# Altium schematic sheet SystemStatusBoard.SchDoc
size C
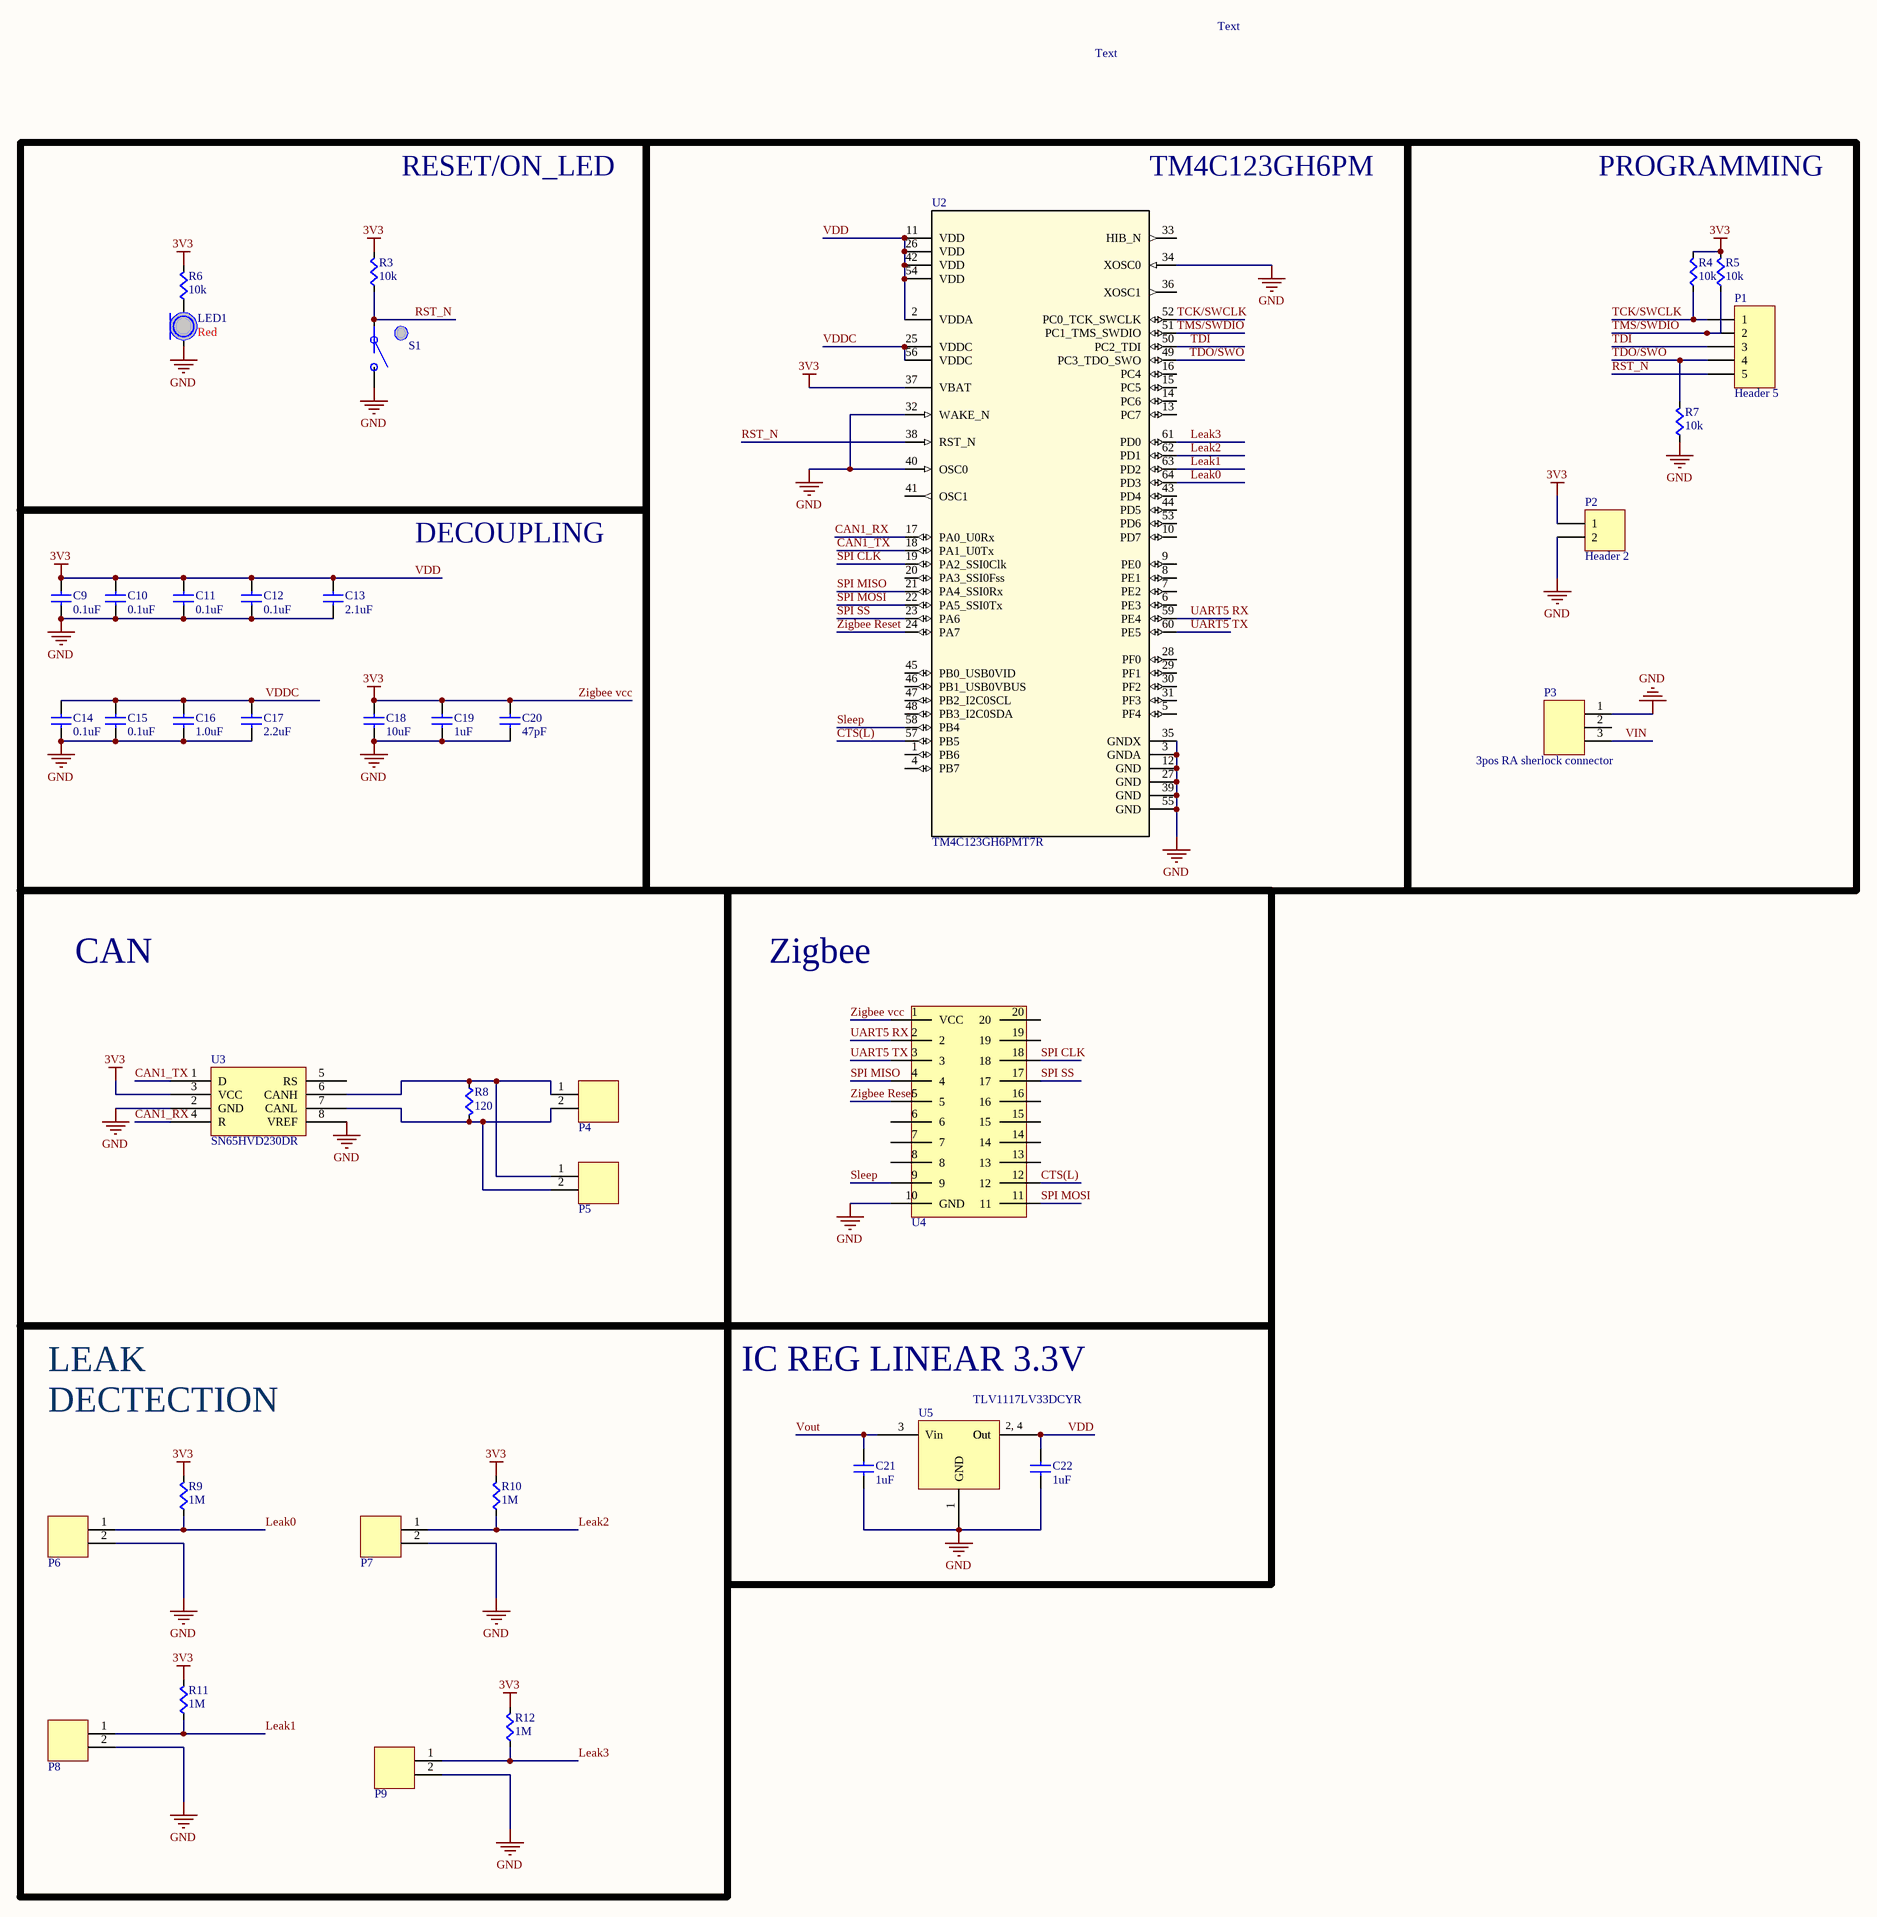
[diagram p0: SystemStatusBoard.SchDoc]

## Parts
C9  value 0.1uF  [CAPC0603]  (hidden comment: Cap)
C10  value 0.1uF  [CAPC0603]  (hidden comment: Cap)
C11  value 0.1uF  [CAPC0603]  (hidden comment: Cap)
C12  value 0.1uF  [CAPC0603]  (hidden comment: Cap)
C13  value 2.1uF  [CAPC0603]  (hidden comment: Cap)
C14  value 0.1uF  [CAPC0603]  (hidden comment: Cap)
C15  value 0.1uF  [CAPC0603]  (hidden comment: Cap)
C16  value 1.0uF  [CAPC0603]  (hidden comment: Cap)
C17  value 2.2uF  [CAPC0603]  (hidden comment: Cap)
C18  value 10uF  [CAPC0603]  (hidden comment: Cap)
C19  value 1uF  [CAPC0603]  (hidden comment: Cap)
C20  value 47pF  [CAPC0603]  (hidden comment: Cap)
C21  value 1uF  [CAPC0603]  (hidden comment: Cap)
C22  value 1uF  [CAPC0603]  (hidden comment: Cap)
LED1  Color: Red  [LED0603]  (hidden comment: LED)
P1  Header 5  [HDR1X5]
P2  Header 2  [HDR1X2]
P3  3pos RA sherlock connector  [MOLEX-HDR-1X3-SHERLOCK-RA]
P4  2-pin Horz Sherlock  [MOLEX-HDR-1X2-SHERLOCK-HORZ]  (value not drawn)
P5  2-pin Horz Sherlock  [MOLEX-HDR-1X2-SHERLOCK-HORZ]  (value not drawn)
P6  2-pin Vert Sherlock  [MOLEX-HDR-1X2-SHERLOCK-VERT]  (value not drawn)
P7  2-pin Vert Sherlock  [MOLEX-HDR-1X2-SHERLOCK-VERT]  (value not drawn)
P8  2-pin Vert Sherlock  [MOLEX-HDR-1X2-SHERLOCK-VERT]  (value not drawn)
P9  2-pin Vert Sherlock  [MOLEX-HDR-1X2-SHERLOCK-VERT]  (value not drawn)
R3  value 10k  [RES0603]  (hidden comment: Res)
R4  value 10k  [RES0603]  (hidden comment: Res)
R5  value 10k  [RES0603]  (hidden comment: Res)
R6  value 10k  [RES0603]  (hidden comment: Res)
R7  value 10k  [RES0603]  (hidden comment: Res)
R8  value 120  [RES0603]  (hidden comment: Res)
R9  value 1M  [RES0603]  (hidden comment: Res)
R10  value 1M  [RES0603]  (hidden comment: Res)
R11  value 1M  [RES0603]  (hidden comment: Res)
R12  value 1M  [RES0603]  (hidden comment: Res)
S1  Button  [PTS645xxxxSMTR92]  (value not drawn)
U2  TM4C123GH6PMT7R  [PM0064A_N]
U3  SN65HVD230DR  [SOIC-8pin]
U4  XBee  [XBee]  (value not drawn)
U5  TLV1117LV33DCYR  [SOT23-4N]

## Blocks framed on the sheet
RESET/ON_LED: LED1 R3 R6 S1
TM4C123GH6PM: U2
PROGRAMMING: P1-P3 R4 R5 R7
DECOUPLING: C9-C20
CAN: P4 P5 R8 U3
Zigbee: U4
IC REG LINEAR 3.3V: C21 C22 U5

## Nets
GND: C9.2(B) C10.2(B) C11.2(B) C12.2(B) C13.2(B) C14.2(B) C15.2(B) C16.2(B) C17.2(B) C18.2(B) C19.2(B) C20.2(B) C21.2(B) C22.2(B) LED1.C P2.2 P3.1 P6.2 P7.2 P8.2 P9.2 R7.2(B) S1.B U2.3(GNDA) U2.12(GND) U2.27(GND) U2.32(WAKE_N) U2.34(XOSC0) U2.35(GNDX) U2.39(GND) U2.40(OSC0) U2.55(GND) U3.2(GND) U3.8(VREF) U4.10(GND) U5.1(GND)
VDD: C9.1(A) C10.1(A) C11.1(A) C12.1(A) C13.1(A) C18.1(A) C19.1(A) C20.1(A) C22.1(A) P2.1 R3.1(A) R4.1(A) R5.1(A) R6.1(A) R9.1(A) R10.1(A) R11.1(A) R12.1(A) U2.2(VDDA) U2.11(VDD) U2.26(VDD) U2.37(VBAT) U2.42(VDD) U2.54(VDD) U3.3(VCC) U4.1(VCC) U5.2(Out) U5.4(Out)  [also labelled 3V3, Zigbee vcc]
CAN1_RX: U2.17(PA0_U0Rx) U3.4(R)
CAN1_TX: U2.18(PA1_U0Tx) U3.1(D)
CTS(L): U2.57(PB5) U4.12
Leak0: P6.1 R9.2(B) U2.64(PD3)
Leak1: P8.1 R11.2(B) U2.63(PD2)
Leak2: P7.1 R10.2(B) U2.62(PD1)
Leak3: P9.1 R12.2(B) U2.61(PD0)
RST_N: P1.5 R3.2(B) S1.A U2.38(RST_N)
Sleep: U2.58(PB4) U4.9
SPI CLK: U2.19(PA2_SSI0Clk) U4.18
SPI MISO: U2.21(PA4_SSI0Rx) U4.4
SPI MOSI: U2.22(PA5_SSI0Tx) U4.11
SPI SS: U2.23(PA6) U4.17
TCK/SWCLK: P1.1 R4.2(B) U2.52(PC0_TCK_SWCLK)
TDI: P1.3 U2.50(PC2_TDI)
TDO/SWO: P1.4 R7.1(A) U2.49(PC3_TDO_SWO)
TMS/SWDIO: P1.2 R5.2(B) U2.51(PC1_TMS_SWDIO)
UART5 RX: U2.59(PE4) U4.2
UART5 TX: U2.60(PE5) U4.3
VDDC: C14.1(A) C15.1(A) C16.1(A) C17.1(A) U2.25(VDDC) U2.56(VDDC)
VIN: P3.3
Vout: C21.1(A) U5.3(Vin)
Zigbee Reset: U2.24(PA7) U4.5
NetLED1_A: LED1.A R6.2(B)
NetP4_1: P4.1 P5.1 R8.2(B) U3.6(CANH)
NetP4_2: P4.2 P5.2 R8.1(A) U3.7(CANL)

Not connected (* = marked no-connect by the designer): P3 2; U2 1(PB6) 4(PB7) 5(PF4) 6(PE3) 7(PE2) 8(PE1) 9(PE0) 10(PD7) 13(PC7) 14(PC6) 15(PC5) 16(PC4) 20(PA3_SSI0Fss) 28(PF0) 29(PF1) 30(PF2) 31(PF3) 33(HIB_N) 36(XOSC1) 41(OSC1) 43(PD4) 44(PD5) 45(PB0_USB0VID) 46(PB1_USB0VBUS) 47(PB2_I2C0SCL) 48(PB3_I2C0SDA) 53(PD6); U3 5(RS); U4 6 7 8 13 14 15 16 19 20

## Notes on the sheet
- Text
- (near R9) LEAK DECTECTION
- (in symbol TLV1117LV33DCYR) 2, 4

## Library data of the parts
C21 C22 = Cap: Manufacturer Part Number: C0603C105K8PACTU; Supplier 1: Digi-Key; Supplier Part Number 1: 399-3118-1-ND
P1 = Header 5: Header, 5-Pin; LatestRevisionDate: 17-Jul-2002; LatestRevisionNote: Re-released for DXP Platform.; Publisher: Altium Limited
P2 = Header 2: Header, 2-Pin; LatestRevisionDate: 17-Jul-2002; LatestRevisionNote: Re-released for DXP Platform.; Publisher: Altium Limited
P3 = MOLEX-HDR-1x3-SHERLOCK_RA: Header, Molex, 2mm Pitch Sherlock Header, Single Row, Right Angle 3 Circuits, Length 3.3mm; Manufacturer Part Number: 35363-0360; Manufacturer: Molex Connector Corporation; Supplier Part Number 1: WM18932-ND; Supplier 1: Digi-Key
P4 P5 = MOLEX-HDR-1x2-SHERLOCK_RA: Header, Molex, 2mm Pitch Sherlock Header, Single Row, Horizontal, 2 Circuits, Length 3.3mm,  0353630260; Manufacturer: Molex Inc; Manufacturer Part Number: 0353630260; Supplier Part Number 1: WM18931-ND; Supplier 1: Digi-Key
P6-P9 = MOLEX-HDR-1x2-SHERLOCK_VERT: Header, Molex, 2mm Pitch Sherlock Header, Single Row, Vertical, 2 Circuits, Length 3.3mm, 0353620250; Manufacturer Part Number: *; Order Part Number: *
S1 = Button: SPST Button; Supplier 1: Digi-Key; Supplier Part Number 1: CKN9087CT-ND
U2 = TM4C123GH6PMT7R: Imported; PartNumber: TM4C123GH6PMTR; Manufacturer: Texas Instruments; CompType: IC; PIN_COUNT: 64; Application_BuildNumber: *; Alternate_PartNumber: TM4C123GH6PMT; PackageReference: PM0064A; MountType: SMT; RoHS: Y; RefDes: RefDes; TYPE: TYPE; Value: Value
U3 = SN65HVD230DR: IC TXRX CAN 1MBPS 3.3V 8SOIC; Supplier 1: Digi-Key; Supplier Part Numbe 1: 296-11654-1-ND
U4 = XBee: XBee radio; Supplier 1: Digi-Key; Supplier Part Number 1: 602-1181-ND
U5 = TLV1117LV33DCYR: IC REG LINEAR 3.3V 1A SOT223-4; Digi-Key Part Number: 296-28778-1-ND
C9-C20 = Cap: Supplier 1: Digi-Key; Supplier Part Number 1: 1276-1000-1-ND
LED1 = LED: Supplier 1: Digi-Key; Supplier Part Number 1: 754-1122-1-ND
R3-R12 = Res: Supplier 1: Digi-Key; Supplier Part Number 1: RMCF0603JT10K0CT-ND